# Altium schematic sheet MCU.SchDoc: Microcontroller
size A4; Engineer: CT; SheetNumber: 2; SheetTotal: 5; SPICEModelCacheWAOLYTKC: <root> / <DocumentId>WAOLYTKC</DocumentId> / </root>
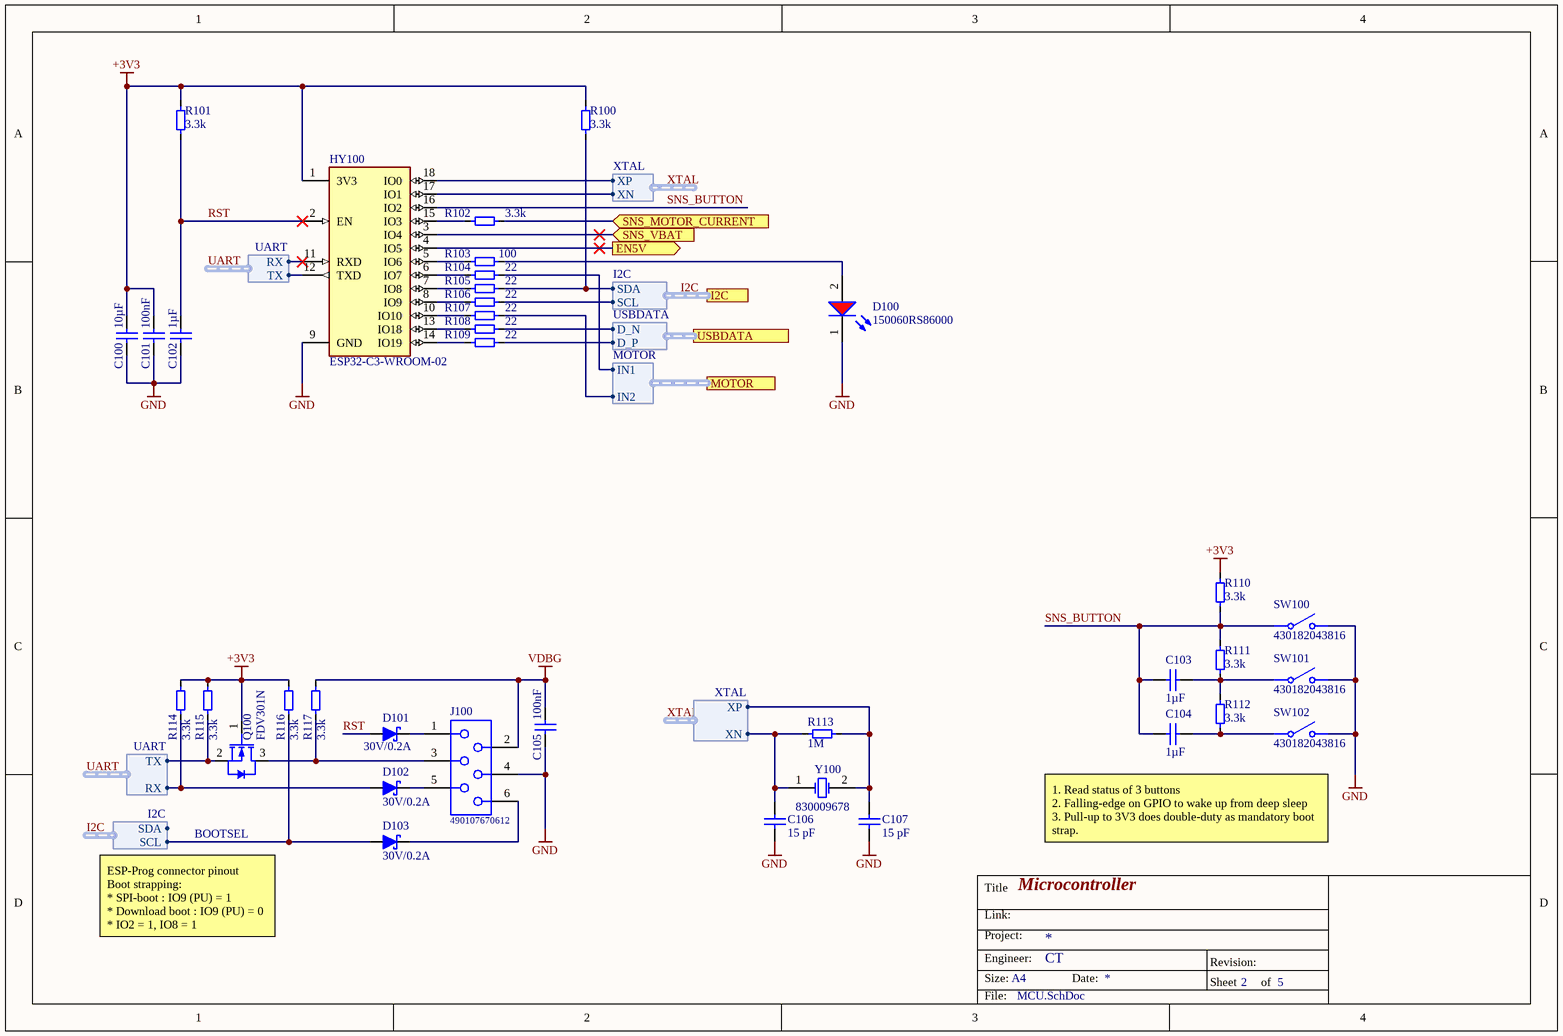
[diagram p0: MCU.SchDoc]

## Parts
C100  value 10µF  [1206-C-L]  (hidden comment: Capacitor 10µF +/-10% 16V X7R 1206)
C101  value 100nF  [0603-C-L]  (hidden comment: Capacitor 100nF +/-10% 10V X7R 0603)
C102  value 1µF  [0603-C-L]  (hidden comment: Capacitor 1µF +/-10% 16V X7R 0603)
C103  value 1µF  [0603-C-L]  (hidden comment: Capacitor 1µF +/-10% 16V X7R 0603)
C104  value 1µF  [0603-C-L]  (hidden comment: Capacitor 1µF +/-10% 16V X7R 0603)
C105  value 100nF  [0603-C-L]  (hidden comment: Capacitor 100nF +/-10% 10V X7R 0603)
C106  value 15 pF  [0603-C-L]  (hidden comment: Capacitor 15 pF +/-5% 50V C0G 0603)
C107  value 15 pF  [0603-C-L]  (hidden comment: Capacitor 15 pF +/-5% 50V C0G 0603)
D100  150060RS86000  [WL-SMCW_0603_150060xx8x000]
D101  value 30V/0.2A  [SOD-123-N]  (hidden comment: BAT54T1G)
D102  value 30V/0.2A  [SOD-123-N]  (hidden comment: BAT54T1G)
D103  value 30V/0.2A  [SOD-123-N]  (hidden comment: BAT54T1G)
HY100  ESP32-C3-WROOM-02  [ESP32­C3­WROOM­02]
J100  490107670612  [490107670612_Debugging Application]  (no BOM)
Q100  FDV301N  [SOT-23-3-N]
R100  value 3.3k  [0603-R-N]  (hidden comment: Resistor 3.3k +/-1% 75V 0603)
R101  value 3.3k  [0603-R-N]  (hidden comment: Resistor 3.3k +/-1% 75V 0603)
R102  value 3.3k  [0603-R-N]  (hidden comment: Resistor 3.3k +/-1% 75V 0603)
R103  value 100  [0603-R-N]  (hidden comment: Resistor 100R +/-1% 75V 0603)
R104  value 22  [0603-R-N]  (hidden comment: Resistor 22R +/-1% 75V 0603)
R105  value 22  [0603-R-N]  (hidden comment: Resistor 22R +/-1% 75V 0603)
R106  value 22  [0603-R-N]  (hidden comment: Resistor 22R +/-1% 75V 0603)
R107  value 22  [0603-R-N]  (hidden comment: Resistor 22R +/-1% 75V 0603)
R108  value 22  [0603-R-N]  (hidden comment: Resistor 22R +/-1% 75V 0603)
R109  value 22  [0603-R-N]  (hidden comment: Resistor 22R +/-1% 75V 0603)
R110  value 3.3k  [0603-R-N]  (hidden comment: Resistor 3.3k +/-1% 75V 0603)
R111  value 3.3k  [0603-R-N]  (hidden comment: Resistor 3.3k +/-1% 75V 0603)
R112  value 3.3k  [0603-R-N]  (hidden comment: Resistor 3.3k +/-1% 75V 0603)
R113  value 1M  [0603-R-N]  (hidden comment: Resistor 1M +/-1% 75V 0603)
R114  value 3.3k  [0603-R-N]  (hidden comment: Resistor 3.3k +/-1% 75V 0603)
R115  value 3.3k  [0603-R-N]  (hidden comment: Resistor 3.3k +/-1% 75V 0603)
R116  value 3.3k  [0603-R-N]  (hidden comment: Resistor 3.3k +/-1% 75V 0603)
R117  value 3.3k  [0603-R-N]  (hidden comment: Resistor 3.3k +/-1% 75V 0603)
SW100  430182043816  [WS-TASV_L6W6H4.3_4301x20438x6]
SW101  430182043816  [WS-TASV_L6W6H4.3_4301x20438x6]
SW102  430182043816  [WS-TASV_L6W6H4.3_4301x20438x6]
Y100  830009678  [WE-XTAL_CFPX-217]

## Ports
EN5V (out), I2C (harness I2C), MOTOR (harness MOTOR), SNS_MOTOR_CURRENT (in), SNS_VBAT (in), USBDATA (harness USBDATA)

## Harnesses
USBDATA: D_N, D_P
XTAL: XN, XP
UART: RX, TX
I2C: SDA, SCL
MOTOR: IN1, IN2

## Nets
+3V3: C100.2 C101.2 HY100.1(3V3) Q100.1(G) R100.2 R101.2 R110.2 R114.2 R115.2 R116.2
GND: C100.1 C101.1 C102.1 C105.1 C106.1 C107.1 D100.1(K) HY100.9(GND) J100.4 SW100.2 SW101.2 SW102.2
VDBG: C105.2 J100.2 R117.2
EN5V: HY100.4(IO5) ; port EN5V
I2C.SCL: D103.2(A) R106.2 R116.1 ; port I2C.SCL
I2C.SDA: R100.1 R105.2 ; port I2C.SDA
RST: C102.2 D101.2(A) HY100.2(EN) R101.1
SNS_BUTTON: C103.1 C104.1 HY100.16(IO2) R110.1 R111.2 SW100.1
SNS_MOTOR_CURRENT: R102.2 ; port SNS_MOTOR_CURRENT
SNS_VBAT: HY100.3(IO4) ; port SNS_VBAT
UART.RX: D102.2(A) HY100.11(RXD) R114.1 ; harness UART.RX
UART.TX: HY100.12(TXD) Q100.2(S) R115.1 ; harness UART.TX
XTAL.XN: C106.2 HY100.17(IO1) R113.1 Y100.1(OSC1) ; harness XTAL.XN
XTAL.XP: C107.2 HY100.18(IO0) R113.2 Y100.2(OSC2) ; harness XTAL.XP
NetC103_2: C103.2 R111.1 R112.2 SW101.1
NetC104_2: C104.2 R112.1 SW102.1
NetD100_2: D100.2(A) R103.2
NetD101_1: D101.1(C) J100.1
NetD102_1: D102.1(C) J100.5
NetD103_1: D103.1(C) J100.6
NetHY100_5: HY100.5(IO6) R103.1
NetHY100_6: HY100.6(IO7) R104.1
NetHY100_7: HY100.7(IO8) R105.1
NetHY100_8: HY100.8(IO9) R106.1
NetHY100_10: HY100.10(IO10) R107.1
NetHY100_13: HY100.13(IO18) R108.1
NetHY100_14: HY100.14(IO19) R109.1
NetHY100_15: HY100.15(IO3) R102.1
NetJ100_3: J100.3 Q100.3(D) R117.1
NetR104_2: R104.2 ; port MOTOR.IN1
NetR107_2: R107.2 ; port MOTOR.IN2
NetR108_2: R108.2 ; port USBDATA.D_N
NetR109_2: R109.2 ; port USBDATA.D_P

## Buses and harness runs
harness I2C = port I2C

## Notes on the sheet
- BOOTSEL
- 1. Read status of 3 buttons
  2. Falling-edge on GPIO to wake up from deep sleep
  3. Pull-up to 3V3 does double-duty as mandatory boot strap.
- ESP-Prog connector pinout
  Boot strapping:
  * SPI-boot : IO9 (PU) = 1
  * Download boot : IO9 (PU) = 0
  * IO2 = 1, IO8 = 1
- Title
- Link:
- Size:
- Project:
- Engineer:
- A4
- Date:
- Revision:
- Sheet
- of
- File:

## Library data of the parts
C100 = CMP-072-000800-12: WCAP-CSGP Multilayer Ceramic Chip Capacitor, General Purpose, size 1206, X7R, 10µF, 16VDC; Technical Reference: X7R1206106K016DFCT10000; Tolerance: 10%; Capacitor Type: MLCC; Insulation Resistance: 0.01GO; Length: 3.2mm; ComponentLink2URL: https://www.we-online.com/redexpert/spec/885012208041?ad; Packaging: Tape and Reel; ComponentLink1Description: Website Link; Design Item ID: 885012208041; Source: WCAP-CSGP.SchLib; ComponentLink2Description: Datasheet Link; Pins: 2; Usage: General Purpose; Voltage Rating: 16V; Height: 1.6mm; ComponentLink1URL: https://www.we-online.com/redexpert/article/885012208041?ad; Dielectric: X7R; Mounting Technology: SMT; Dissipation Factor: 10%; Min Operating Temperature: -55°C; Width: 1.6mm; Max Operating Temperature: 125°C; Case/Package: 1206; Match Code: WCAP-CSGP; JLCPCB Part #: C13585
C101 C105 = CMP-001-00113-8: Capacitor MLCC, General Purpose, size 0603, X7R, 100nF, +/-10%, 10V; Tolerance: 10%; Ripple Current: 10; Capacitor Type: MLCC; Length: 1.6mm; Dielectric: X7R; Height: 0.8mm; Pins: 2; RoHS Compliant: True; Min Operating Temperature: -55°C; Usage: General Purpose; Mounting Technology: SMT; Case/Package: 0603; Width: 0.8mm; Max Operating Temperature: 125°C; Voltage Rating: 10V; JLCPCB Part #: C14663
C102-C104 = CMP-001-00004-18: Capacitor MLCC, General Purpose, size 0603, X7R, 1µF, +/-10%, 16V; Tolerance: 10%; Usage: General Purpose; Mounting Technology: SMT; Width: 0.8mm; Voltage Rating: 16V; RoHS Compliant: True; Capacitor Type: MLCC; Case/Package: 0603; Min Operating Temperature: -55°C; Dielectric: X7R; Pins: 2; Max Operating Temperature: 125°C; Length: 1.6mm; Height: 0.8mm; JLCPCB Part #: C15849
C106 C107 = CMP-001-00107-9: Capacitor MLCC, General Purpose, size 0603, C0G, 15 pF, +/-5%, 50V; Tolerance: 5%; Min Operating Temperature: -55°C; RoHS Compliant: Yes; Dielectric: C0G; Width: 0.8mm; Voltage Rating: 50V; Pins: 2; Height: 0.8mm; Max Operating Temperature: 125°C; Usage: General Purpose; Case/Package: 0603; Mounting Technology: SMT; Capacitor Type: MLCC; Length: 1.6mm
D100 = CMP-002-001080-3: WL-SMCW Mono-color Chip LED Waterclear, size 0603, Red, 2V, 60°; Manufacturer: Wurth Elektronik; Chip Technology: AlInGaP; Case/Size Code: 0603; Luminous Intensity: 800mcd; Dominant Wavelength: 624nm; Peak Wavelength: 632nm; Forward Voltage: 2V; ComponentLink2URL: https://www.we-online.com/redexpert/spec/150060RS86000?ad; Operating Temperature Min: -40°C; ComponentLink1URL: https://www.we-online.com/redexpert/article/150060RS86000?ad; Viewing Angle: 60°; Operating Temperature Max: 85°C; Manufacturer Part Number: 150060RS86000; Packaging: Tape and Reel; ComponentLink2Description: Datasheet Link; Design Item ID: 150060RS86000; Width: 0.8mm; Emitting Color: Red; Length: 1.6mm; Pin Count: 2; Match Code: WL-SMCW; Source: WL-SMCW.SchLib; Height: 0.95mm; Component Type: Standard; Category: Signal LEDs; ComponentLink1Description: Website Link; Mount: Surface Mount
D101-D103 = CMP-004-00035-8: Diode Schottky 30V 200mA (DC) Surface Mount SOD-123; Manufacturer: onsemi; Ir - Reverse Current: 2 uA; Ifsm - Forward Surge Current: 600 mA; Vf - Forward Voltage: 800 mV; Forward Voltage: 800mV; Forward Current If: 200 mA; Reverse Voltage Vr: 30 V; Case/Package: SOD-123; Datasheet: https://www.onsemi.com/products/discrete-power-modules/schottky-diodes-schottky-rectifiers/bat54t; Operating Temperature: -55C to 125C; JLCPCB Part #: C8598; Max Reverse Voltage (DC): 30V; Forward Current: 200mA
HY100 = CMP-019-000004-4: Module with 4 MB flash and on­board PCB antenna / Built around RISC­V single­core SoC / Supporting 2.4 GHz Wi­Fi and Bluetooth 5; pin to pad: 9>0+9; Design Item ID: ESP32-C3-WROOM-02; Source: 7c7_Modules.SchLib; Component Type: Standard; Pin Count: 19
J100 = CMP-002-000028-6: WR-WST REDFIT IDC SKEDD, pitch 2.54mm, 6pins; Contact Resistance max.: 10mOhm; Gender: Transition; Rated Current: 1A; Pin Number: 6; Working Voltage: 100V(AC); Connector Type: Cable,IDC; Design Item ID: 490107670612; Source: WR-WST.SchLib; Packaging: Tube; ComponentLink2Description: Datasheet; Part Number: 490107670612; ComponentLink1Description: Manufacturer; Operating Temperature: -25 to +105degC; Pitch: 2.54mm; ComponentLink1URL: http://www.we-online.de; Published Date: November 2019; Mounting Technology: Press-In; Publisher: Wurth Elektronik; ComponentLink2URL: https://katalog.we-online.com/em/datasheet/490107670612.pdf; RoHS Compliant: Yes; Contact Plating: Gold; Series: REDFIT WR-WST
Q100 = CMP-013-00055-3: Transistor MOSFET N-Ch. 25V 220mA 0, 35W 4Ohm SOT23; Number of Channels: 1; Rise Time: 6ns; Rds On Max: 4R; Vgs (Max): 8V; Max Power Dissipation: 350mW; Input Capacitance: 9.5pF; Polarity: N-CHANNEL; Drain to Source Resistance: 5R; Vgs(th) (Max) @ Id: 1.06V @250µA; Transistor Type: NMOS; Turn-Off Delay Time: 3.5ns; Turn-On Delay Time: 3.2ns; Packaging: Tape and Reel; Series: -; Length: 2.9mm; Weight: 0.001093oz; Continuous Drain Current (ID): 220mA; Width: 1.3mm; Vds Max: 25V; Height: 1.2mm; Mounting Technology: Surface Mount; Gate to Source Voltage (Vgs): 8V; Min Operating Temperature: -55°C; Case/Package: SOT-23-3; Fall Time: 6ns; Id - Continuous Drain Current: 220mA; Pins: 3; Drain to Source Voltage (Vdss): 25V; Max Operating Temperature: 150°C; Package Quantity: 3000
R100-R102 R110-R112 R114-R117 = CMP-009-00243-9: Chip Resistor, Thick Film, General Purpose, 0603, 100mW, 75V, 3.3 kOhm, +/-1%; Tolerance: 1%; Elements: 1; Resistor Type: Thick Film; RoHS Compliant: Yes; Voltage Rating: 75V; Usage: General Purpose; Case/Package: 0603; Pins: 2; Power Rating: 100mW; Mounting Technology: SMT; Min Operating Temperature: -55°C; JLCPCB Part #: C22978; Max Operating Temperature: 155°C
R103 = CMP-009-00232-9: Chip Resistor, Thick Film, General Purpose, 0603, 63mW, 75V, 100 Ohm, +/-1%; Tolerance: 1%; Elements: 1; Temperature Coefficient: 100ppm/°C; Voltage Rating: 75V; Mounting Technology: SMT; Max Operating Temperature: 155°C; Min Operating Temperature: -55°C; Usage: General Purpose; Case/Package: 0603; Pins: 2; JLCPCB Part #: C22775; RoHS Compliant: Yes; Power Rating: 63mW; Resistor Type: Thick Film
R104-R109 = CMP-009-00027-17: Chip Resistor, Thick Film, General Purpose, 0603, 100mW, 75V, 22 Ohm, +/-1%; Tolerance: 1%; Elements: 1; Min Operating Temperature: -55°C; Pins: 2; Case/Package: 0603; Usage: General Purpose; Voltage Rating: 75V; Power Rating: 100mW; Mounting Technology: SMT; Resistor Type: Thick Film; Max Operating Temperature: 155°C; RoHS Compliant: True
R113 = CMP-009-00234-8: Chip Resistor, Thick Film, General Purpose, 0603, 100mW, 75V, 1 MOhm, +/-1%; Tolerance: 1%; Elements: 1; Pins: 2; Mounting Technology: SMT; Max Operating Temperature: 155°C; Power Rating: 100mW; Resistor Type: Thick Film; Usage: General Purpose; RoHS Compliant: Yes; Voltage Rating: 75V; Case/Package: 0603; Min Operating Temperature: -55°C
SW100-SW102 = CMP-002-000142-4: WS-TASV SMT Tact Switch, 12VDC, 50mA, 160g, height 4.3mm; pin to pad: 1>A1+A2 2>B1+B2; Manufacturer: Wurth Elektronik; Electrical Life: 1000000Cycles; Actuator Color: Black; Rated Voltage: 12V; Washable: No; Length: 6mm; Terminal Plating: Silver; ComponentLink2Description: Datasheet; Packaging: Tape and Reel; Terminal Material: Copper Alloy; ComponentLink2URL: https://www.we-online.com/catalog/datasheet/430182043816.pdf; Operating Temperature min.: -40C; Source: WS-TASV.SchLib; Operating Temperature max.: 85C; Mounting Technology: SMT; Contact Plating: Silver; Contact Material: Stainless Steel; Operation Force: 160g; ComponentLink1Description: Manufacturer Link; Manufacturer Part Number: 430182043816; Rated Current: 50mA; Pin Count: 4; Design Item ID: 430182043816; ComponentLink1URL: http://www.we-online.de; Width: 6mm; Height: 4.3mm; Component Type: Standard
Y100 = CMP-030-000070-1: WE-XTAL Watch Crystal, SMT, CFPX-217, 32.768kHz, +/-20ppm; Manufacturer: Wurth Elektronik; Load Capacitance: 12.5pF; Manufacturer Part Number: 830009678; ComponentLink1Description: Manufacturer; Size: CFPX-217; Mounting Technology: SMT; Packaging: Tape and Reel; ComponentLink2URL: https://katalog.we-online.com/pbs/datasheet/830009678.pdf; Frequency Tolerance: +/-20ppm; Operating Temperature: -40 to +85degC; Component Type: Standard; Frequency Stability: -; Design Item ID: 830009678; Frequency: 32.768kHz; Pin Count: 2; ComponentLink1URL: http://www.we-online.de; Published Date: July 2020; Source: WE-XTAL_CFPX-217.SchLib; ComponentLink2Description: Datasheet